# EasyEDA schematic IN OUT.json
TITLE: TRICORE | ALU | CMP; REV: 1.0; Date: 2022-01-04; Sheet: 1/?; Drawn By: Koehler, Paul; Company: komed3
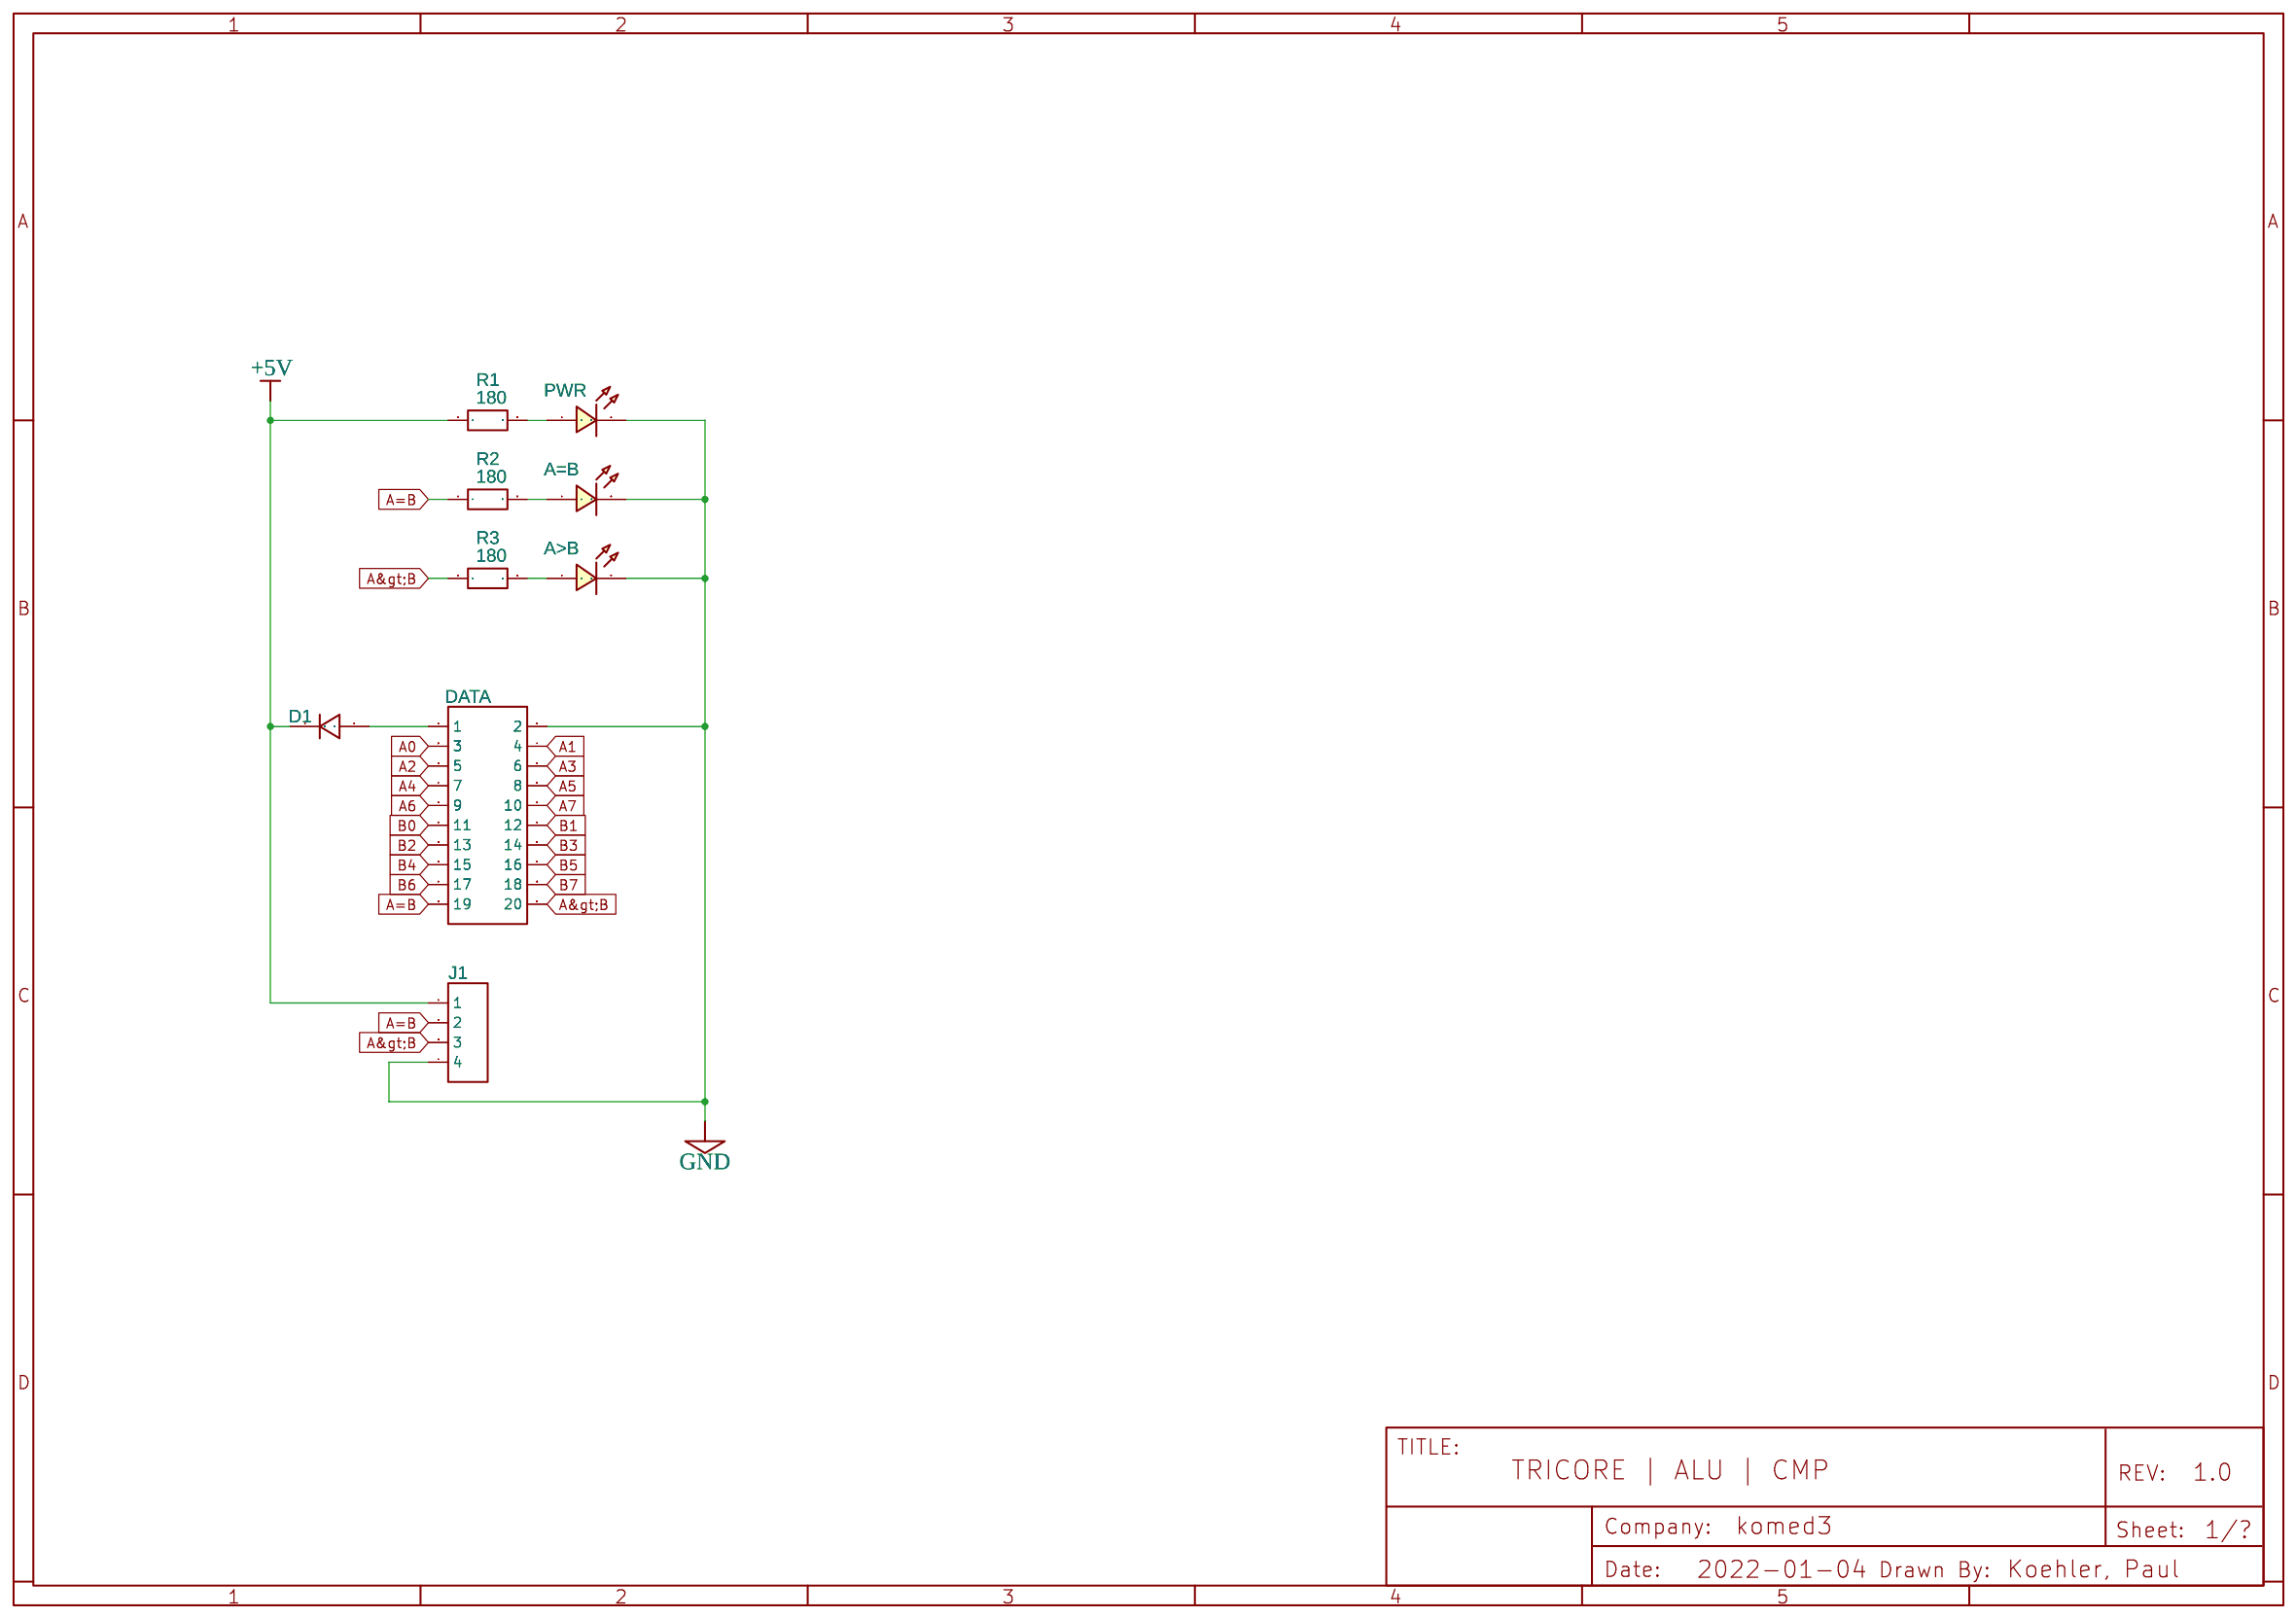
[diagram p0: schematic sheet]

## Parts
A=B  LED-TH-5mm_R  [LED-TH_BD5.0_RED]
A>B  LED-TH-5mm_R  [LED-TH_BD5.0_RED]
D1  1N4007  [DO-41_BD2.4-L4.7-P8.70-D0.9-RD]
DATA  HDR-IDC-2.54-2X10P  [IDC-TH_20P-P2.54-V-R2-C10-S2.54]
J1  HDR-M-2.54_1x4  [HDR-M-2.54_1X4]
PWR  LED-TH-5mm_R  [LED-TH_BD5.0_RED]
R1  180  [R_AXIAL-0.3]
R2  180  [R_AXIAL-0.3]
R3  180  [R_AXIAL-0.3]

## Library data of the parts
A=B A>B PWR = LED-TH-5mm_R: Manufacturer: EVERLIGHT(台湾亿光); Manufacturer Part: 333-2SURD/S530-A3; Supplier Part: C87271; Supplier: LCSC; Contributor: LCEDA_Lib
D1 = 1N4007: Supplier: LCSC; Manufacturer: SEMTECH; Supplier Part: C106903; Contributor: LCEDA_Lib
DATA = HDR-IDC-2.54-2X10P: Supplier: LCSC; Manufacturer: BOOMELE; Manufacturer Part: IDC Box 2.54mm 2X10P　Straight; image: //image.lceda.cn/szlcsc/C3405.jpg; Supplier Part: C3405
J1 = HDR-M-2.54_1x4: Supplier Part: C124378; Supplier: LCSC; Contributor: LCEDA_Lib
R1-R3 = R_AXIAL-0.3_EU: Contributor: LCEDA_Lib

## Nets
+5V: D1.1 J1.1 R1.1
GND: A=B.2 A>B.2 DATA.2 J1.4 PWR.2
A0: DATA.3
A1: DATA.4
A2: DATA.5
A3: DATA.6
A4: DATA.7
A5: DATA.8
A6: DATA.9
A7: DATA.10
A>B: DATA.20 J1.3 R3.1
A=B: DATA.19 J1.2 R2.1
B0: DATA.11
B1: DATA.12
B2: DATA.13
B3: DATA.14
B4: DATA.15
B5: DATA.16
B6: DATA.17
B7: DATA.18
Net-(A=B-1): A=B.1 R2.2
Net-(A>B-1): A>B.1 R3.2
Net-(D1-2): D1.2 DATA.1
Net-(PWR-1): PWR.1 R1.2
